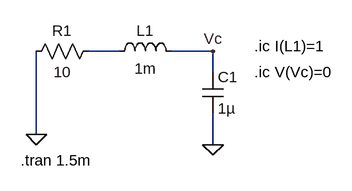
[diagram p0: schematic RLC_sourceFree_with_inductor_initial_condition.asc]
RLC_sourceFree_with_inductor_initial_condition.asc, the LTspice schematic file:
Version 4
SHEET 1 880 680
WIRE 112 80 64 80
WIRE 256 80 192 80
WIRE 256 112 256 80
WIRE -16 208 -16 80
WIRE 256 224 256 176
FLAG 256 224 0
FLAG -16 208 0
FLAG 256 80 Vc
SYMBOL res 80 64 R90
WINDOW 0 0 56 VBottom 2
WINDOW 3 32 56 VTop 2
SYMATTR InstName R1
SYMATTR Value 10
SYMBOL ind 96 96 R270
WINDOW 0 32 56 VTop 2
WINDOW 3 5 56 VBottom 2
SYMATTR InstName L1
SYMATTR Value 1m
SYMBOL cap 240 112 R0
SYMATTR InstName C1
SYMATTR Value 1µ
TEXT 320 72 Left 2 !.ic I(L1)=1
TEXT 320 112 Left 2 !.ic V(Vc)=0
TEXT -40 248 Left 2 !.tran 1.5m

The netlist it stands for:
* RLC_sourceFree_with_inductor_initial_condition.asc
R1 N001 0 10
L1 N001 Vc 1m
C1 Vc 0 1µ
.ic I(L1)=1
.ic V(Vc)=0
.tran 1.5m
.backanno
.end